# Altium schematic sheet Récepteur_manchesteur.SchDoc
size A4
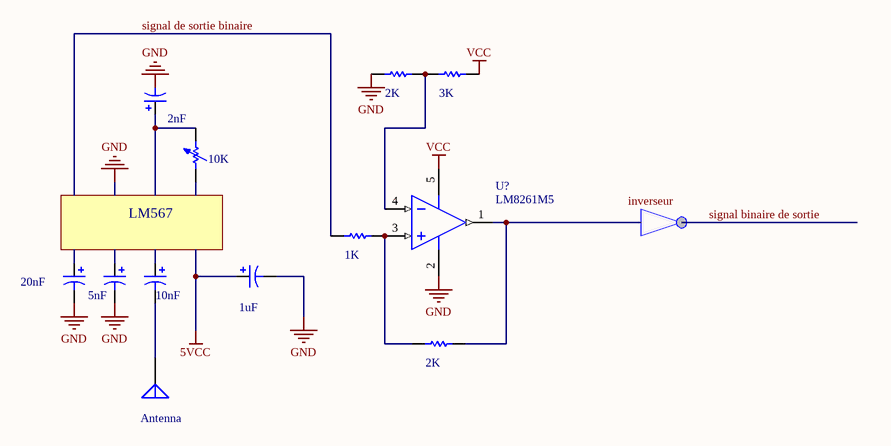
[diagram p0: Récepteur_manchesteur.SchDoc]

## Parts
2  value 2K  [AXIAL-0.3]  (hidden comment: Res1)
4  value 2K  [AXIAL-0.3]  (hidden comment: Res1)
5  value 3K  [AXIAL-0.3]  (hidden comment: Res1)
C1  value 20nF  [RB7.6-15]  (hidden comment: Cap Pol1)
C2  value 5nF  [RB7.6-15]  (hidden comment: Cap Pol1)
C3  value 10nF  [RB7.6-15]  (hidden comment: Cap Pol1)
C5  value 2nF  [RB7.6-15]  (hidden comment: Cap Pol1)
c56  value 1uF  [RB7.6-15]  (hidden comment: Cap Pol1)
E?  Antenna  [PIN1]
R12  value 10K  [AXIAL-0.7]  (hidden comment: Res Adj1)
R?  value 1K  [AXIAL-0.3]  (hidden comment: Res1)
U?  LM8261M5  [MF05A_N]

## Nets
5VCC: c56.1
GND: 4.1 C1.2 C2.2 c56.2 U?.2(V-)
VCC: 5.2 U?.5(V+)
signal de sortie binaire: R?.1
Net2_1: 2.1 R?.2 U?.3(IN+)
Net2_2: 2.2 U?.1(OUT)
Net4_2: 4.2 5.1 U?.4(IN-)
NetC3_2: C3.2 E?.1(A)
NetC5_1: C5.1 R12.2

Not connected (* = marked no-connect by the designer): C1 1; C2 1; C3 1; C5 2; R12 1

## Notes on the sheet
- LM567
- Labels drawn without touching a wire or pin: GND, inverseur

## Library data of the parts
2 4 5 R? = Res1: Resistor; Published: 8-Jun-2000; LatestRevisionDate: 17-Jul-2002; LatestRevisionNote: Re-released for DXP Platform.; PackageReference: AXIAL-0.3; Publisher: Altium Limited; PackageDescription: Axial Device, Thru-Hole; 2 Leads; 0.3 in Pin Spacing
C1-C3 C5 c56 = Cap Pol1: Polarized Capacitor (Radial); Published: 8-Jun-2000; LatestRevisionDate: 17-Jul-2002; LatestRevisionNote: Re-released for DXP Platform.; PackageReference: RB7.6-15; Publisher: Altium Limited; PackageDescription: Polarized Capacitor (Radial); 2 Leads
E? = Antenna: Generic Antenna; Published: 24-Mar-1999; LatestRevisionDate: 17-Jul-2002; LatestRevisionNote: Re-released for DXP Platform.; PackageReference: PIN1; Publisher: Altium Limited
R12 = Res Adj1: Variable Resistor; Set Position: 0.5; Published: 8-Jun-2000; LatestRevisionDate: 17-Jul-2002; LatestRevisionNote: Re-released for DXP Platform.; PackageReference: AXIAL-0.7; Publisher: Altium Limited; PackageDescription: Axial Device, Thru-Hole; 2 Leads; 0.7 in Pin Spacing
U? = LM8261M5: RRIO, High Output Current & Unlimited Cap Load Op Amp in SOT23-5; Manufacturer: National Semiconductor; CompType: Amplifiers; PackageTopMarking: A45A*XTT; PowerWise: N; Published: 4-Dec-2008; LatestRevisionDate: 13-Jan-2009; LatestRevisionNote: Sim Model Added.; DatasheetVersion: Apr-2006; PackageVersion: revD, Aug-2008; PackageReference: MF05A; Publisher: Altium Limited; PackageDescription: Molded SOT-23, .115 x .063 x .040 in Body, 5 Lead, .0375 in Pitch; PartNumber: LM8261M5; RoHS: O; PinCount: 5; DigiKeyPartNumber: LM8261M5CT-ND; Code_IPC: SOT23-5; ComponentLink1Description: LM8261 Datasheet; ComponentLink1URL: http://www.national.com/ds/LM/LM8261.pdf; ComponentLink2Description: LM8261 Web Page; ComponentLink2URL: http://www.national.com/pf/LM/LM8261.html; ComponentLink3Description: MF05A Package Page; ComponentLink3URL: http://www.national.com/packaging/folders/mf05a.html